# Altium project Bin-Image.PrjPcb
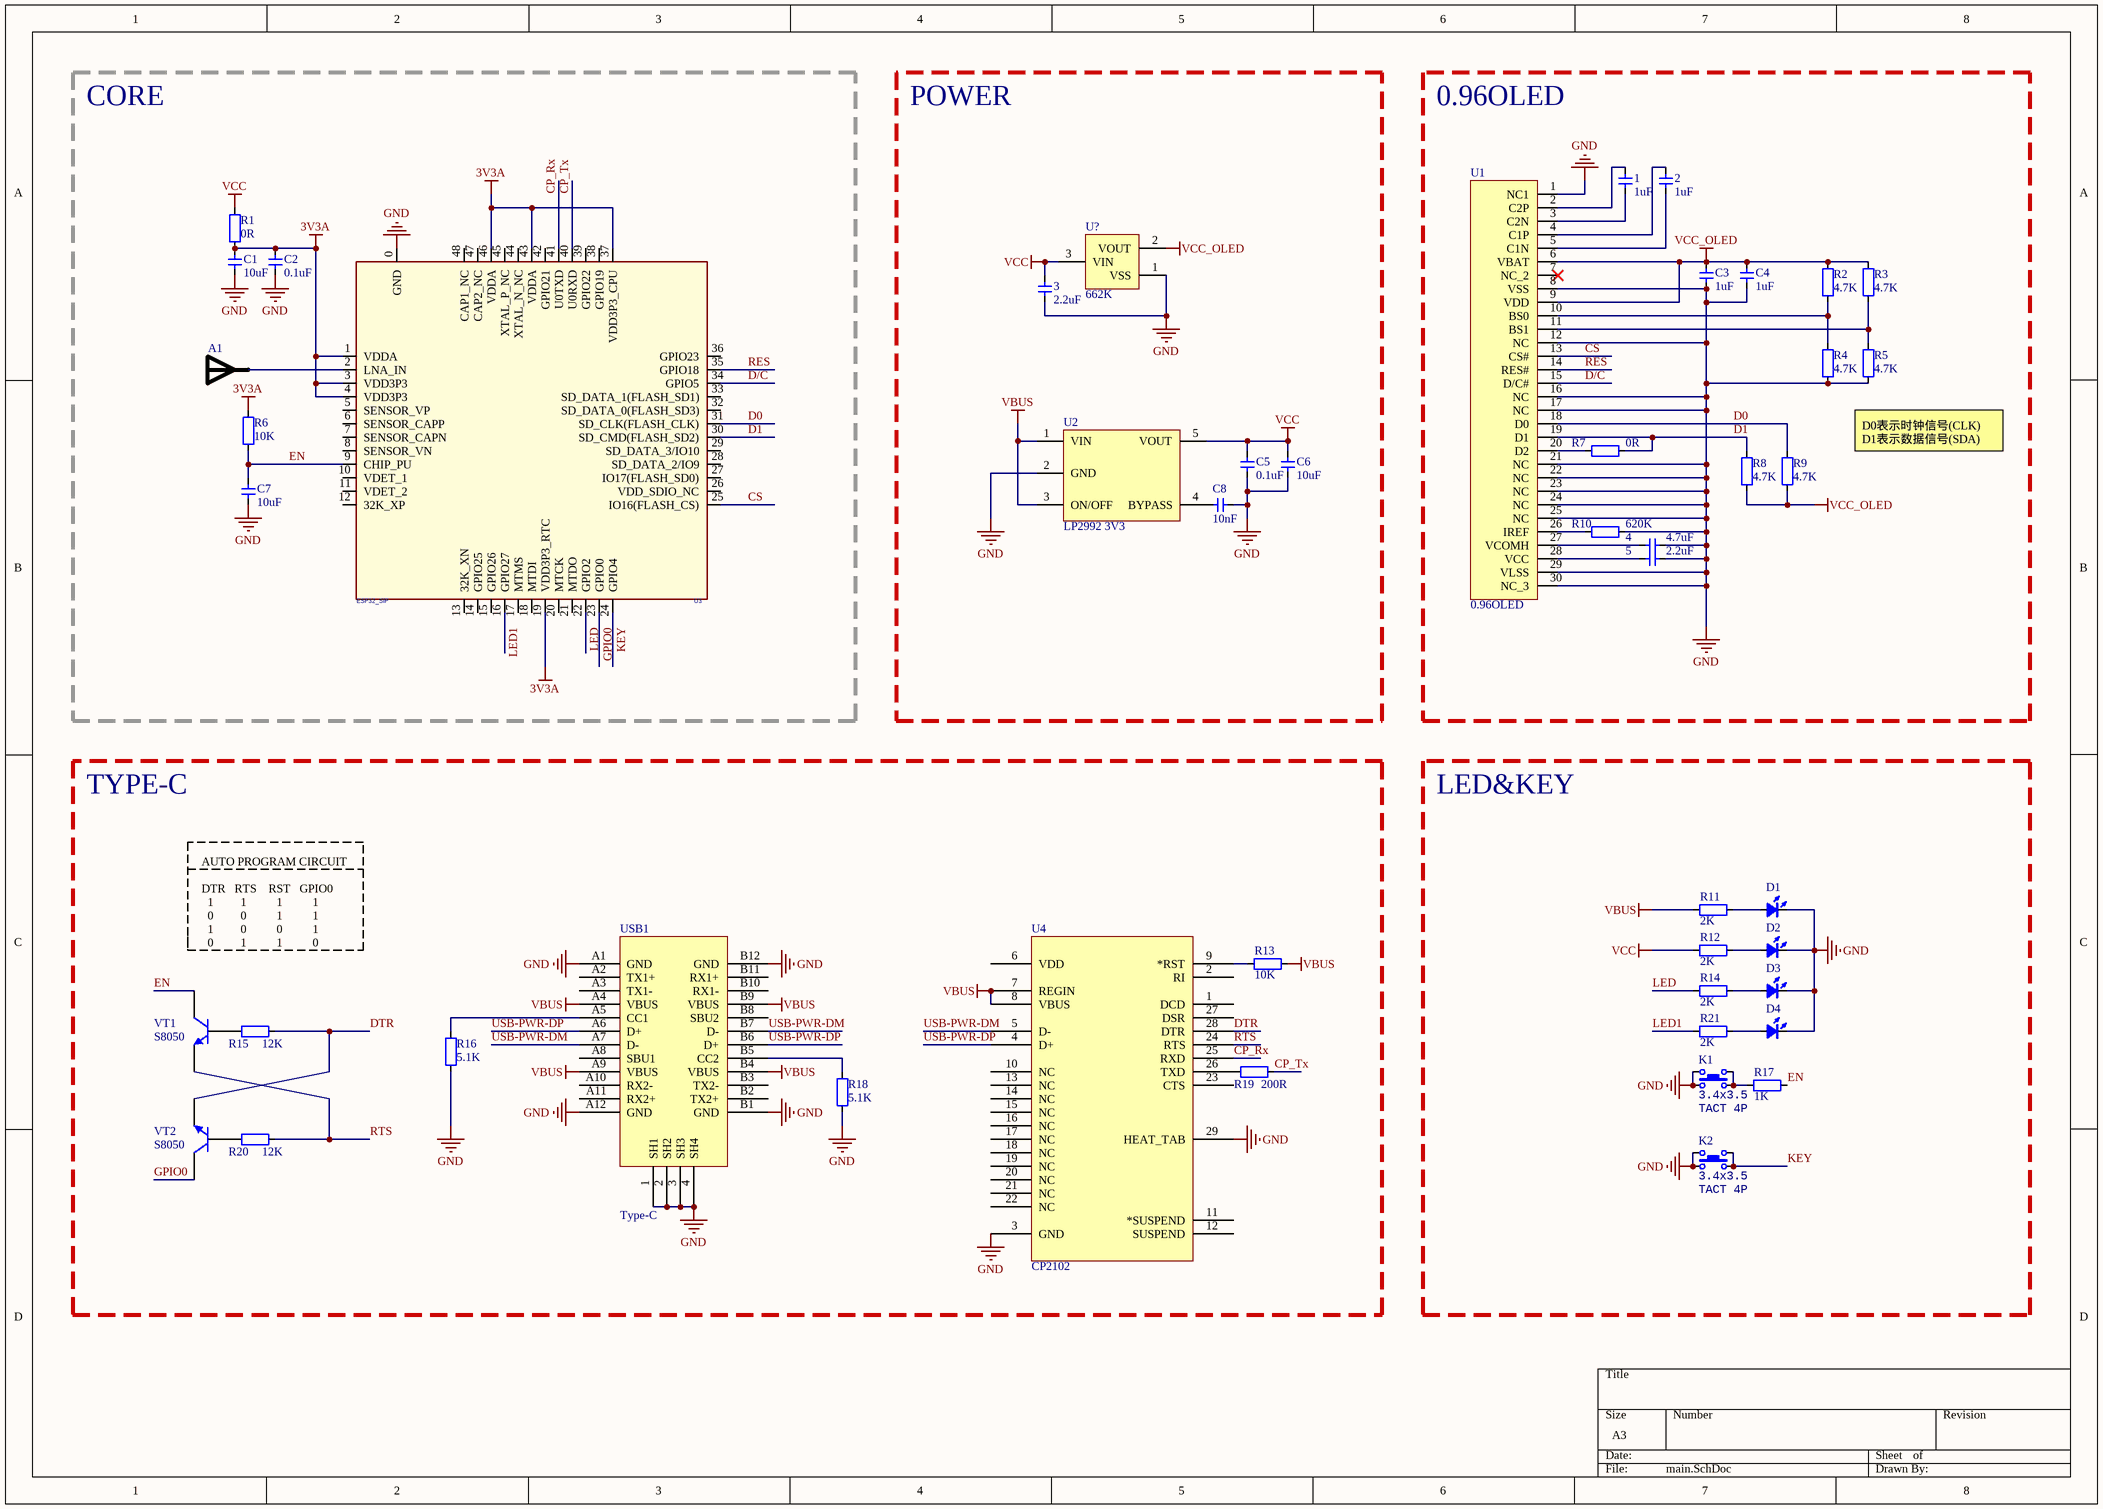
[diagram p0: main.SchDoc]
1 sheet, 49 parts. Net scope: global (net labels, ports and power ports of the same name join across sheets).
Board file: Bin-Image.PcbDoc

## Sheet main.SchDoc
size A3; SheetNumber: 1; SheetTotal: 1

### Parts
1  1uF  [CAP_0402]
2  1uF  [CAP_0402]
3  2.2uF  [CAP_0402]
4  4.7uF  [CAP_0402]
5  2.2uF  [CAP_0402]
A1  RAINSUN  [ANT-Rainsun-AN5120]  (value not drawn)
C1  10uF  [CAP_0402]
C2  0.1uF  [CAP_0402]
C3  1uF  [CAP_0402]
C4  1uF  [CAP_0402]
C5  0.1uF  [CAP_0402]
C6  10uF  [CAP_0402]
C7  10uF  [CAP_0402]
C8  10nF  [CAP_0402]
D1  color?  [LED_0402_RED]  (value not drawn)
D2  color?  [LED_0402_RED]  (value not drawn)
D3  color?  [LED_0402_RED]  (value not drawn)
D4  color?  [LED_0402_RED]  (value not drawn)
K1  value 3.4x3.5  [ButtonTACT_3.5*3.55_90]  (hidden comment: TACT 4P)
K2  value 3.4x3.5  [ButtonTACT_3.5*3.55_90]  (hidden comment: TACT 4P)
R1  0R  [RES_0402]
R2  4.7K  [RES_0402]
R3  4.7K  [RES_0402]
R4  4.7K  [RES_0402]
R5  4.7K  [RES_0402]
R6  10K  [RES_0402]
R7  0R  [RES_0402]
R8  4.7K  [RES_0402]
R9  4.7K  [RES_0402]
R10  620K  [RES_0402]
R11  2K  [RES_0402]
R12  2K  [RES_0402]
R13  10K  [RES_0402]
R14  2K  [RES_0402]
R15  12K  [RES_0402]
R16  5.1K  [RES_0402]
R17  1K  [RES_0402]
R18  5.1K  [RES_0402]
R19  200R  [RES_0402]
R20  12K  [RES_0402]
R21  2K  [RES_0402]
U1  0.96OLED  [OLED-0.96-30Pin]
U2  LP2992 3V3  [SOT23-5]
U3  ESP32_SIP  [QFN-48_7X7]
U4  CP2102  [QFN-28]
U?  662K  [SOT23]
USB1  Type-C  [Type-C-TOP]
VT1  S8050  [SMT_TRIODE_NPN]
VT2  S8050  [SMT_TRIODE_NPN]

### Blocks framed on the sheet
CORE: A1 C1 C2 C7 R1 R6 U3
POWER: 3 C5 C6 C8 U2 U?
0.96OLED: 1 2 4 5 C3 C4 R2-R5 R7-R10 U1
TYPE-C: R13 R15 R16 R18-R20 U4 USB1 VT1 VT2
LED&KEY: D1-D4 K1 K2 R11 R12 R14 R17 R21

### Nets
3V3A: C1.2 C2.2 R1.1 R6.2 U3.1(VDDA) U3.3(VDD3P3) U3.4(VDD3P3) U3.19(VDD3P3_RTC) U3.37(VDD3P3_CPU) U3.43(VDDA) U3.46(VDDA)
GND: 3.1 4.1 5.1 C1.1 C2.1 C3.1 C4.1 C5.1 C6.1 C7.1 C8.2 D1.2(K) D2.2(K) D3.2(K) D4.2(K) K1.1 K1.3 K2.1 K2.3 R4.1 R5.1 R10.1 R16.2 R18.2 U1.1(NC1) U1.8(VSS) U1.12(NC) U1.16(NC) U1.17(NC) U1.21(NC) U1.22(NC) U1.23(NC) U1.24(NC) U1.25(NC) U1.29(VLSS) U1.30(NC_3) U2.2(GND) U3.0(GND) U4.3(GND) U4.29(HEAT_TAB) U?.1(VSS) USB1.1(SH1) USB1.2(SH2) USB1.3(SH3) USB1.4(SH4) USB1.A1(GND) USB1.A12(GND) USB1.B1(GND) USB1.B12(GND)
VBUS: R11.1 R13.1 U2.1(VIN) U2.3(ON/OFF) U4.7(REGIN) U4.8(VBUS) USB1.A4(VBUS) USB1.A9(VBUS) USB1.B4(VBUS) USB1.B9(VBUS)
VCC: 3.2 C5.2 C6.2 R1.2 R12.1 U2.5(VOUT) U?.3(VIN)
VCC_OLED: C3.2 C4.2 R2.2 R3.2 R8.1 R9.1 U1.6(VBAT) U1.9(VDD) U?.2(VOUT)
CP_Rx: U3.41(U0TXD) U4.25(RXD)
CP_Tx: R19.1 U3.40(U0RXD)
CS: U1.13(CS#) U3.25(IO16(FLASH_CS))
D0: R9.2 U1.18(D0) U3.31(SD_CLK(FLASH_CLK))
D1: R7.1 R8.2 U1.19(D1) U3.30(SD_CMD(FLASH_SD2))
D/C: U1.15(D/C#) U3.34(GPIO5)
DTR: R15.1 U4.28(DTR) VT2.2(E)
EN: C7.2 R6.1 R17.2 U3.9(CHIP_PU) VT1.3(C)
GPIO0: U3.23(GPIO0) VT2.3(C)
KEY: K2.2 K2.4 U3.24(GPIO4)
LED: R14.1 U3.22(GPIO2)
LED1: R21.1 U3.16(GPIO27)
RES: U1.14(RES#) U3.35(GPIO18)
RTS: R20.1 U4.24(RTS) VT1.2(E)
USB-PWR-DM: U4.5(D-) USB1.A7(D-) USB1.B7(D-)
USB-PWR-DP: U4.4(D+) USB1.A6(D+) USB1.B6(D+)
Net1_1: 1.1 U1.3(C2N)
Net1_2: 1.2 U1.2(C2P)
Net2_1: 2.1 U1.5(C1N)
Net2_2: 2.2 U1.4(C1P)
Net4_2: 4.2 U1.27(VCOMH)
Net5_2: 5.2 U1.28(VCC)
NetA1_1: A1.1 U3.2(LNA_IN)
NetC8_1: C8.1 U2.4(BYPASS)
NetD1_1: D1.1(A) R11.2
NetD2_1: D2.1(A) R12.2
NetD3_1: D3.1(A) R14.2
NetD4_1: D4.1(A) R21.2
NetK1_2: K1.2 K1.4 R17.1
NetR2_1: R2.1 R4.2 U1.10(BS0)
NetR3_1: R3.1 R5.2 U1.11(BS1)
NetR7_2: R7.2 U1.20(D2)
NetR10_2: R10.2 U1.26(IREF)
NetR13_2: R13.2 U4.9(*RST)
NetR15_2: R15.2 VT1.1(B)
NetR16_1: R16.1 USB1.A5(CC1)
NetR18_1: R18.1 USB1.B5(CC2)
NetR19_2: R19.2 U4.26(TXD)
NetR20_2: R20.2 VT2.1(B)

Not connected (* = marked no-connect by the designer): U1 7(NC_2)*; U3 5(SENSOR_VP) 6(SENSOR_CAPP) 7(SENSOR_CAPN) 8(SENSOR_VN) 10(VDET_1) 11(VDET_2) 12(32K_XP) 13(32K_XN) 14(GPIO25) 15(GPIO26) 17(MTMS) 18(MTDI) 20(MTCK) 21(MTDO) 26(VDD_SDIO_NC) 27(IO17(FLASH_SD0)) 28(SD_DATA_2/IO9) 29(SD_DATA_3/IO10) 32(SD_DATA_0(FLASH_SD3)) 33(SD_DATA_1(FLASH_SD1)) 36(GPIO23) 38(GPIO19) 39(GPIO22) 42(GPIO21) 44(XTAL_N_NC) 45(XTAL_P_NC) 47(CAP2_NC) 48(CAP1_NC); U4 1(DCD) 2(RI) 6(VDD) 10(NC) 11(*SUSPEND) 12(SUSPEND) 13(NC) 14(NC) 15(NC) 16(NC) 17(NC) 18(NC) 19(NC) 20(NC) 21(NC) 22(NC) 23(CTS) 27(DSR); USB1 A2(TX1+) A3(TX1-) A8(SBU1) A10(RX2-) A11(RX2+) B2(TX2+) B3(TX2-) B8(SBU2) B10(RX1-) B11(RX1+)

### Notes on the sheet
- D0表示时钟信号(CLK)
  D1表示数据信号(SDA)
- AUTO PROGRAM CIRCUIT
  DTR   RTS    RST   GPIO0
  1         1          1          1
  0         0          1          1
  1         0          0          1
  0         1          1          0

### Library data of the parts
1-5 C1-C8 = 电容-0402: Capacitor; Value: 0.1u
A1 = ANT-Rainsun-AP5120
D1-D4 = LED_0402: LED; Type: 0402; Value: color?
K1 K2 = ButtonTACT: Button; type: TACT 4P
R1-R21 = 电阻-0402: Resistor; Value: 22R
U1 = 0.96OLED: 焊接式 0.96OLED 30pin 0.7
U2 = LP2992: LDO
U3 = ESP32-PICO
U4 = CP2102: USB转TTL; PART DESC: SINGLE-CHIP USB TO UART BRIDGE, QFN28, RoHS.; MFG #1: SILICON LABS; PART NUMBER: CP2102; Value: Value; RefDes: RefDes; Type: DEV
U? = XC6206P332MR
USB1 = USB-Type-C-TOP
VT1 VT2 = SMT_TRIODE_NPN: Surface mount NPN transistor, package SOT-23